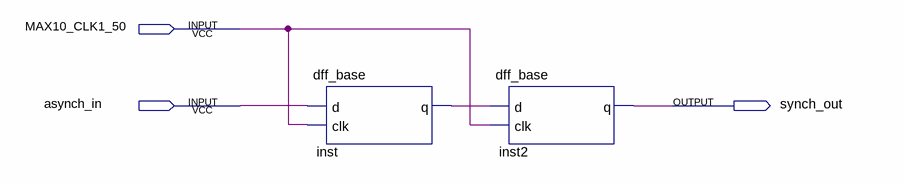
[diagram p0: schematic sheet]
// Quartus schematic sincronizzatore_ottimo.bdf as structural Verilog: 2 symbols, 3 pins
module sincronizzatore_ottimo (
  input  MAX10_CLK1_50,
  input  asynch_in,
  output synch_out
);

  wire inst_q;

  dff_base inst (.d(asynch_in), .clk(MAX10_CLK1_50), .q(inst_q));
  dff_base inst2 (.d(inst_q), .clk(MAX10_CLK1_50), .q(synch_out));
endmodule
